# Altium schematic sheet Thingy91_PV_Board.SchDoc
size A4; SheetNumber: 2; SheetTotal: 2
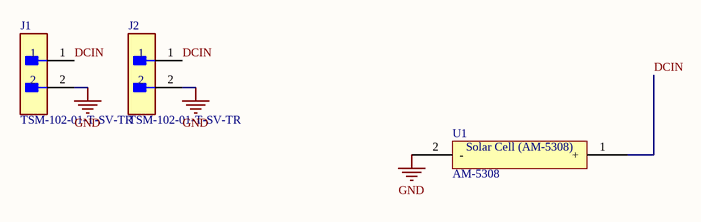
[diagram p0: Thingy91_PV_Board.SchDoc]

## Parts
J1  TSM-102-01-T-SV-TR  [FP-TSM-102-01-T-SV-TR-MFG]
J2  TSM-102-01-T-SV-TR  [FP-TSM-102-01-T-SV-TR-MFG]
U1  AM-5308  [PCBComponent_1]

## Nets
GND: J1.2 J2.2 U1.2(-)
DCIN: J1.1 J2.1 U1.1(+)

## Notes on the sheet
- (in symbol AM-5308) Solar Cell (AM-5308)

## Library data of the parts
J1 J2 = CMP-02766-000113-1: CONN HEADER SMD 2POS 2.54MM; Gender: Male; Max Voltage Rating (AC): 475V; Number of Contacts: 2; Max Current Rating: 7A; Contact Material: Bronze; Min Operating Temperature: -55°C; REACH SVHC: No SVHC; Housing Material: Polymer; Lead Free: Lead Free; Orientation: Straight; Radiation Hardening: No; Number of Rows: 1; Length: 5.08mm; Housing Color: Black; Max Operating Temperature: 105°C; Contact Plating: Tin; Depth: 2.54mm; Packaging: Tape and Reel; Pitch: 2.54mm; Termination: Solder
U1 = AM-5308: AM-5308 Panasonic PV